# Altium schematic sheet MEGA PROJECT CONTROL BOARD.SchDoc
size A; SheetNumber: 1; SheetTotal: 1
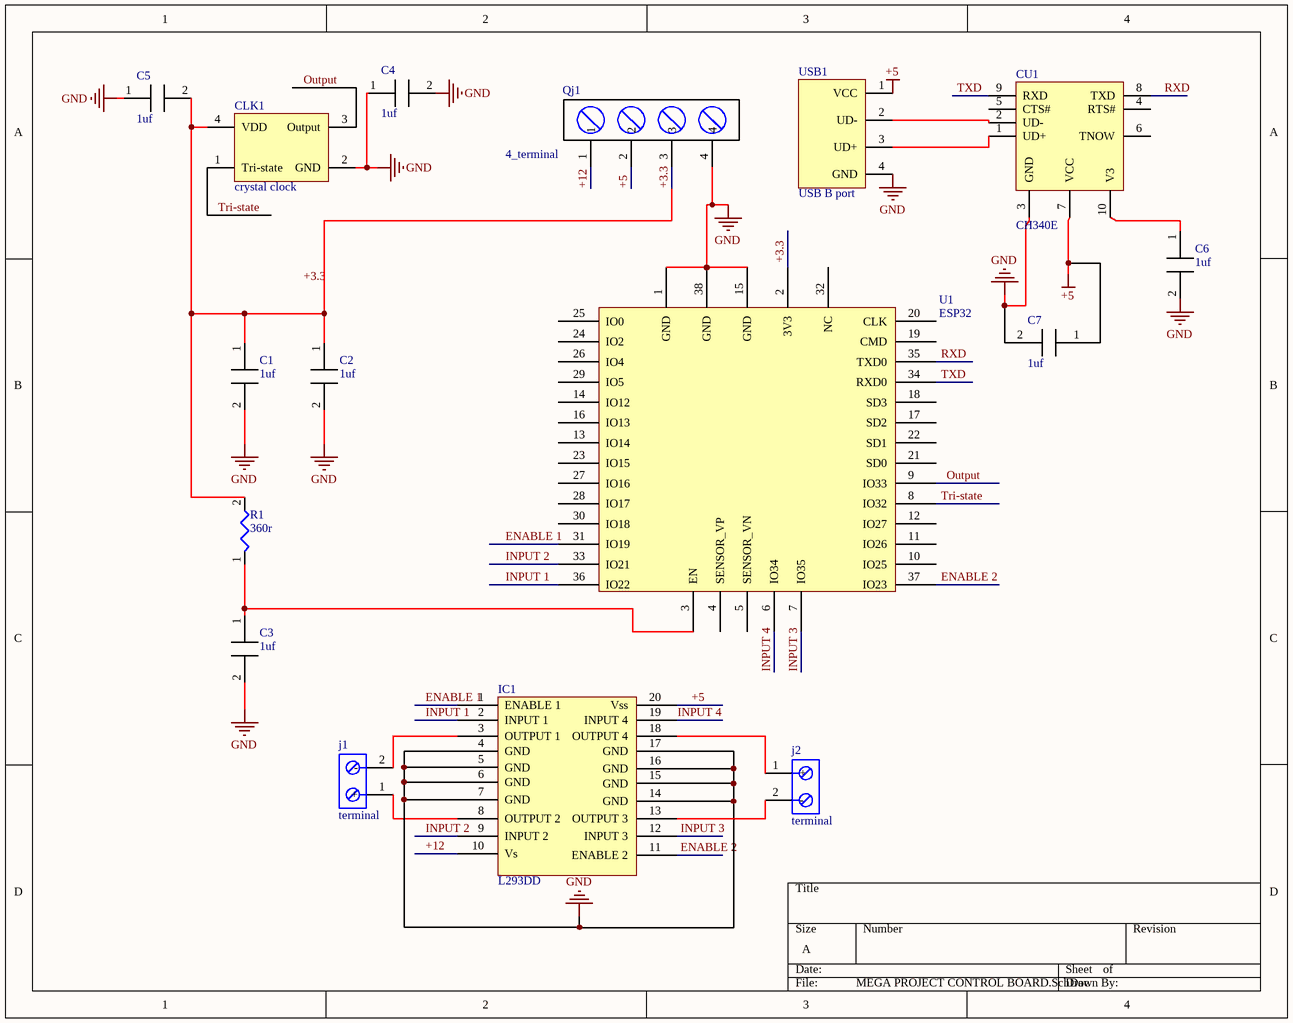
[diagram p0: MEGA PROJECT CONTROL BOARD.SchDoc]

## Parts
C1  1uf  [Capacitor]
C2  1uf  [Capacitor]
C3  1uf  [Capacitor]
C4  1uf  [Capacitor]
C5  1uf  [Capacitor]
C6  1uf  [Capacitor]
C7  1uf  [Capacitor]
CLK1  crystal clock  [Crystal Oscillator]
CU1  CH340E  [CH340E]
IC1  L293DD  [L293DD]
j1  terminal  [terminal]
j2  terminal  [terminal]
Qj1  4_terminal  [4 position terminal block]
R1  360r  [R0805]
U1  ESP32  [ESP32]
USB1  USB B port  [USB B port]

## Nets
+5: C7.1 CU1.7(VCC) IC1.20(Vss) Qj1.2 USB1.1(VCC)
GND: C1.2 C2.2 C3.2 C4.1 C4.2 C5.1 C6.2 C7.2 CLK1.2(GND) CU1.3(GND) IC1.4(GND) IC1.5(GND) IC1.6(GND) IC1.7(GND) IC1.14(GND) IC1.15(GND) IC1.16(GND) IC1.17(GND) Qj1.4 U1.1(GND) U1.15(GND) U1.38(GND) USB1.4(GND)
+3.3: C1.1 C2.1 C5.2 CLK1.4(VDD) Qj1.3 R1.2 U1.2(3V3)
+12: IC1.10(Vs) Qj1.1
ENABLE 1: IC1.1(ENABLE_1) U1.31(IO19)
ENABLE 2: IC1.11(ENABLE_2) U1.37(IO23)
INPUT 1: IC1.2(INPUT_1) U1.36(IO22)
INPUT 2: IC1.9(INPUT_2) U1.33(IO21)
INPUT 3: IC1.12(INPUT_3) U1.7(IO35)
INPUT 4: IC1.19(INPUT_4) U1.6(IO34)
Output: CLK1.3(Output) U1.9(IO33)
RXD: CU1.8(TXD) U1.35(TXD0)
Tri-state: CLK1.1(Tri-state) U1.8(IO32)
TXD: CU1.9(RXD) U1.34(RXD0)
NetC3_1: C3.1 R1.1 U1.3(EN)
NetC6_1: C6.1 CU1.10(V3)
NetCU1_1: CU1.1(UD+) USB1.3(UD+)
NetCU1_2: CU1.2(UD-) USB1.2(UD-)
NetIC1_3: IC1.3(OUTPUT_1) j1.2(-)
NetIC1_8: IC1.8(OUTPUT_2) j1.1(+)
NetIC1_13: IC1.13(OUTPUT_3) j2.2(-)
NetIC1_18: IC1.18(OUTPUT_4) j2.1(+)

Not connected (* = marked no-connect by the designer): CU1 4(RTS#) 5(CTS#) 6(TNOW); U1 4(SENSOR_VP) 5(SENSOR_VN) 10(IO25) 11(IO26) 12(IO27) 13(IO14) 14(IO12) 16(IO13) 17(SD2) 18(SD3) 19(CMD) 20(CLK) 21(SD0) 22(SD1) 23(IO15) 24(IO2) 25(IO0) 26(IO4) 27(IO16) 28(IO17) 29(IO5) 30(IO18) 32(NC)

## Notes on the sheet
- Labels drawn without touching a wire or pin: +3.3

## Library data of the parts
C1-C7 = capacitor: Aluminum Electrolytic Capacitor, Aluminum (wet); Manufacturer: Wurth Electronics; Manufacturer Part Number: 860020672005; Dielectric Material: Aluminium; Supplier: Digikey; Supplier Part Number: 732-8851-1-ND; RoHS: Yes; Category: Aluminum Electrolytic Capacitors; Stock: 10459; Pricing: 1=0.1, 50=0.089, 100=0.078, 250=0.069, 500=0.06, 1000=0.058 (USD); Pins: 2; Capacitor Type: Aluminium; Reach SVHC Compliant: Yes; RoHS Compliant: Yes; ComponentLink1URL: https://datasheet.ciiva.com:443/pdfs/VipMasterIC/IC/MIDC/MIDC-S-A0000764616/MIDC-S-A0000764162-1.pdf?src-supplier=IHS+Markit; ComponentLink1Description: https://datasheet.ciiva.com:443/pdfs/VipMasterIC/IC/MIDC/MIDC-S-A0000764616/MIDC-S-A0000764162-1.pdf?src-supplier=IHS+Markit; ComponentLink2URL: http://www.farnell.com/datasheets/1879647.pdf?src-supplier=Farnell; ComponentLink2Description: http://www.farnell.com/datasheets/1879647.pdf?src-supplier=Farnell; ComponentLink3URL: http://katalog.we-online.de/pbs/datasheet/860020672005.pdf?src-supplier=Digikey; ComponentLink3Description: http://katalog.we-online.de/pbs/datasheet/860020672005.pdf?src-supplier=Digikey; ComponentLink4URL: https://katalog.we-online.de/pbs/datasheet/860020672005.pdf?src-supplier=Digikey; ComponentLink4Description: https://katalog.we-online.de/pbs/datasheet/860020672005.pdf?src-supplier=Digikey; ComponentLink5URL: http://www.farnell.com/datasheets/1879647.pdf?src-supplier=Element14; ComponentLink5Description: http://www.farnell.com/datasheets/1879647.pdf?src-supplier=Element14
CLK1 = Crystal oscillator: Oscillator XO 0.032768MHz ±25ppm 15pF 60% 3.3V 4-Pin SMD T/R; Manufacturer: Abracon; Manufacturer Part Number: ASEK-32.768KHZ-L-R-T; Supplier: Mouser; Supplier Part Number: 815-ASEK-32.7K-LRT; RoHS: No; Stock: 5543; Pricing: 1=1.33, 10=1.04, 50=1.04, 100=0.986, 1000=0.787, 10000=0.696 (USD)
j1 j2 = terminal: Barrier Strip Terminal Block; Manufacturer: Wurth Electronics; Manufacturer Part Number: 691137710002; Supplier: Rs; Supplier Part Number: 1769908; RoHS: No; Category: Terminal Blocks; Stock: 355; Pricing: 500=0.218, 1000=0.202, 2500=0.189 (GBP); RoHS Compliant: Yes; ComponentLink1URL: https://datasheet.ciiva.com:443/pdfs/VipMasterIC/IC/MIDC/MIDC-S-A0005074262/MIDC-S-A0004711666-1.pdf?src-supplier=IHS+Markit; ComponentLink1Description: https://datasheet.ciiva.com:443/pdfs/VipMasterIC/IC/MIDC/MIDC-S-A0005074262/MIDC-S-A0004711666-1.pdf?src-supplier=IHS+Markit; ComponentLink2URL: https://katalog.we-online.de/em/datasheet/691137710002.pdf?src-supplier=Digikey; ComponentLink2Description: https://katalog.we-online.de/em/datasheet/691137710002.pdf?src-supplier=Digikey
Qj1 = quad terminal: Barrier Strip Terminal Block, 12A, 1.5mm2, 1 Row(s), 1 Deck(s); Manufacturer: Phoenix Contact; Manufacturer Part Number: 1934887; Fastening Method: SCREW; Number of Decks: 1; Number of Ways: 4; Voltage Rating: 250V; Wire/Cable Gauge: 14AWG; Safety Approval: UL; Supplier: Rs; Supplier Part Number: 4680931; RoHS: Yes; Category: Terminal Blocks; Stock: 125; Pricing: 5=1.204, 125=1.172, 375=1.14, 1000=1.108, 2000=1.08 (GBP); Mounting Technology: Board; Terminal and Terminal Block Type: BARRIER STRIP TERMINAL BLOCK; Number of Rows: 1; Current Rating: 12A; Wire Cross Section: 1.5mm2; RoHS Compliant: Yes; Reach SVHC Compliant: Yes; ComponentLink1URL: https://www.phoenixcontact.com:443/online/portal/us?uri=pxc-oc-itemdetail%3apid%3d1934887&library=usen&pcck=P-11-02-11&tab=1&src-supplier=IHS+Markit; ComponentLink1Description: https://www.phoenixcontact.com:443/online/portal/us?uri=pxc-oc-itemdetail%3apid%3d1934887&library=usen&pcck=P-11-02-11&tab=1&src-supplier=IHS+Markit; ComponentLink2URL: https://datasheet.ciiva.com/16047/1934887-16047240.pdf?src-supplier=Onlinecomponents.com; ComponentLink2Description: https://datasheet.ciiva.com/16047/1934887-16047240.pdf?src-supplier=Onlinecomponents.com; ComponentLink3URL: https://datasheet.ciiva.com/15169/getdatasheetpartid-177849-15169637.pdf?src-supplier=Verical; ComponentLink3Description: https://datasheet.ciiva.com/15169/getdatasheetpartid-177849-15169637.pdf?src-supplier=Verical; ComponentLink4URL: https://datasheet.ciiva.com/795/combiconcompact5-0mmseries-795415.pdf?src-supplier=Digikey; ComponentLink4Description: https://datasheet.ciiva.com/795/combiconcompact5-0mmseries-795415.pdf?src-supplier=Digikey; ComponentLink5URL: https://datasheet.ciiva.com/14608/70054929-14608235.pdf?src-supplier=Allied+Electronics; ComponentLink5Description: https://datasheet.ciiva.com/14608/70054929-14608235.pdf?src-supplier=Allied+Electronics; ComponentLink6URL: https://datasheet.ciiva.com/29224/744154-da-01-en-printklemme-pt-1-5-4-pvh-5-0-29224875.pdf?src-supplier=Conrad; ComponentLink6Description: https://datasheet.ciiva.com/29224/744154-da-01-en-printklemme-pt-1-5-4-pvh-5-0-29224875.pdf?src-supplier=Conrad
R1 = resistor: Fixed Resistor, Metal Glaze/thick Film, 0.125W, 360ohm, 150V, 1% +/-Tol, 100ppm/Cel, Surface Mount, 0805; Manufacturer: Vishay; Manufacturer Part Number: CRCW0805360RFKEA; Power: 125mW; Rated Temperature: 70°C; Temperature Coefficient: 100ppm/°C; Package Height: 0.45mm; Package Length: 2mm; Package Width: 1.25mm; Reference Standard: AEC-Q200; Supplier: Mouser; Supplier Part Number: 71-CRCW0805360RFKEA; RoHS: Yes; Category: Chip SMD Resistors; Stock: 921; Pricing: 1=0.1, 10=0.025, 50=0.025, 100=0.015, 1000=0.012, 10000=0.008 (USD); Mounting Technology: Surface Mount; Pins: 2; Package Shape: Rectangular; Case/Package: 0805; Terminal Finish: Nickel; Min Operating Temperature: -55°C; Max Operating Temperature: 155°C; Tolerance: 1%; JESD-609 Code: e3; Resistor Type: FIXED RESISTOR; Construction: Chip; Package Style: SMTMeter; Packaging: Tape and Reel; Value: 360R; Technology: METAL GLAZE/THICK FILM; Termination: Wraparound; Working Voltage: 150V; Reach SVHC Compliant: Yes; RoHS Compliant: Yes; ComponentLink1URL: https://datasheet.ciiva.com:443/pdfs/VipMasterIC/IC/VISH/VISH-S-A0007266705/VISH-S-A0007266705-1.pdf?src-supplier=IHS+Markit; ComponentLink1Description: https://datasheet.ciiva.com:443/pdfs/VipMasterIC/IC/VISH/VISH-S-A0007266705/VISH-S-A0007266705-1.pdf?src-supplier=IHS+Markit; ComponentLink2URL: https://datasheet.ciiva.com/2467/dcrcwe3-2467773.pdf?src-supplier=Digikey; ComponentLink2Description: https://datasheet.ciiva.com/2467/dcrcwe3-2467773.pdf?src-supplier=Digikey